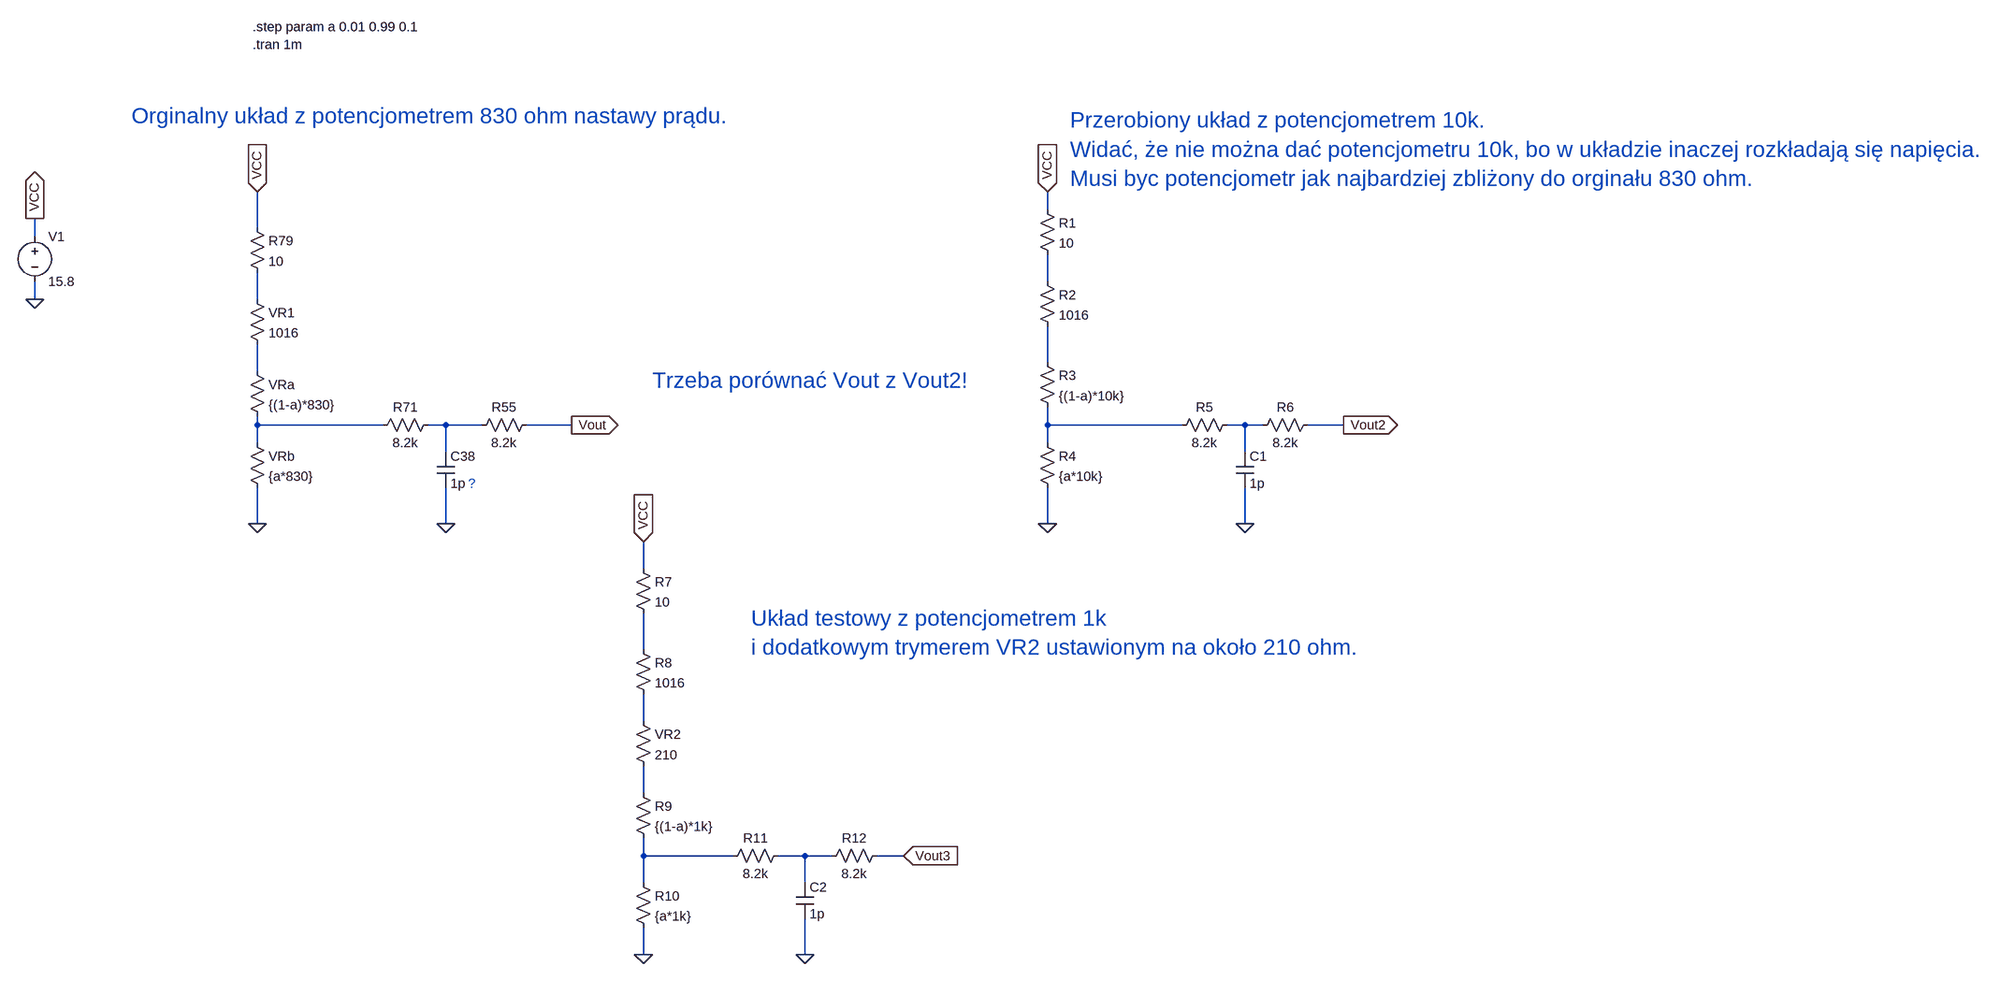
[diagram p0: schematic magnum_power_vip_4000.asc]
magnum_power_vip_4000.asc, the LTspice schematic file:
Version 4
SHEET 1 3352 1364
WIRE 1552 16 1552 -16
WIRE 144 48 144 -16
WIRE -336 64 -336 32
WIRE 1552 144 1552 96
WIRE -336 176 -336 144
WIRE 144 176 144 128
WIRE 1552 288 1552 224
WIRE 144 304 144 256
WIRE 144 400 144 384
WIRE 368 400 144 400
WIRE 480 400 448 400
WIRE 544 400 480 400
WIRE 704 400 624 400
WIRE 1552 400 1552 368
WIRE 1792 400 1552 400
WIRE 1904 400 1872 400
WIRE 1936 400 1904 400
WIRE 2080 400 2016 400
WIRE 144 432 144 400
WIRE 1552 432 1552 400
WIRE 480 448 480 400
WIRE 1904 448 1904 400
WIRE 144 576 144 512
WIRE 480 576 480 512
WIRE 1552 576 1552 512
WIRE 1904 576 1904 512
WIRE 832 656 832 608
WIRE 832 800 832 736
WIRE 832 928 832 880
WIRE 832 1056 832 1008
WIRE 832 1168 832 1136
WIRE 992 1168 832 1168
WIRE 1120 1168 1072 1168
WIRE 1168 1168 1120 1168
WIRE 1296 1168 1248 1168
WIRE 832 1216 832 1168
WIRE 1120 1216 1120 1168
WIRE 832 1344 832 1296
WIRE 1120 1344 1120 1280
FLAG 144 576 0
FLAG 480 576 0
FLAG 144 -16 VCC
IOPIN 144 -16 In
FLAG -336 176 0
FLAG -336 32 VCC
IOPIN -336 32 Out
FLAG 704 400 Vout
IOPIN 704 400 Out
FLAG 1552 576 0
FLAG 1904 576 0
FLAG 1552 -16 VCC
IOPIN 1552 -16 In
FLAG 2080 400 Vout2
IOPIN 2080 400 Out
FLAG 832 1344 0
FLAG 1120 1344 0
FLAG 1296 1168 Vout3
IOPIN 1296 1168 In
FLAG 832 608 VCC
IOPIN 832 608 In
SYMBOL res 128 32 R0
SYMATTR InstName R79
SYMATTR Value 10
SYMBOL res 128 160 R0
SYMATTR InstName VR1
SYMATTR Value 1016
SYMBOL res 128 288 R0
SYMATTR InstName VRa
SYMATTR Value {(1-a)*830}
SYMBOL res 128 416 R0
SYMATTR InstName VRb
SYMATTR Value {a*830}
SYMBOL res 464 384 R90
WINDOW 0 0 56 VBottom 2
WINDOW 3 32 56 VTop 2
SYMATTR InstName R71
SYMATTR Value 8.2k
SYMBOL res 640 384 R90
WINDOW 0 0 56 VBottom 2
WINDOW 3 32 56 VTop 2
SYMATTR InstName R55
SYMATTR Value 8.2k
SYMBOL cap 464 448 R0
SYMATTR InstName C38
SYMATTR Value 1p
SYMBOL voltage -336 48 R0
WINDOW 123 0 0 Left 0
WINDOW 39 0 0 Left 0
SYMATTR InstName V1
SYMATTR Value 15.8
SYMBOL res 1536 0 R0
SYMATTR InstName R1
SYMATTR Value 10
SYMBOL res 1536 128 R0
SYMATTR InstName R2
SYMATTR Value 1016
SYMBOL res 1536 272 R0
SYMATTR InstName R3
SYMATTR Value {(1-a)*10k}
SYMBOL res 1536 416 R0
SYMATTR InstName R4
SYMATTR Value {a*10k}
SYMBOL res 1888 384 R90
WINDOW 0 0 56 VBottom 2
WINDOW 3 32 56 VTop 2
SYMATTR InstName R5
SYMATTR Value 8.2k
SYMBOL res 2032 384 R90
WINDOW 0 0 56 VBottom 2
WINDOW 3 32 56 VTop 2
SYMATTR InstName R6
SYMATTR Value 8.2k
SYMBOL cap 1888 448 R0
SYMATTR InstName C1
SYMATTR Value 1p
SYMBOL res 816 640 R0
SYMATTR InstName R7
SYMATTR Value 10
SYMBOL res 816 784 R0
SYMATTR InstName R8
SYMATTR Value 1016
SYMBOL res 816 1040 R0
SYMATTR InstName R9
SYMATTR Value {(1-a)*1k}
SYMBOL res 816 1200 R0
SYMATTR InstName R10
SYMATTR Value {a*1k}
SYMBOL res 1088 1152 R90
WINDOW 0 0 56 VBottom 2
WINDOW 3 32 56 VTop 2
SYMATTR InstName R11
SYMATTR Value 8.2k
SYMBOL res 1264 1152 R90
WINDOW 0 0 56 VBottom 2
WINDOW 3 32 56 VTop 2
SYMATTR InstName R12
SYMATTR Value 8.2k
SYMBOL cap 1104 1216 R0
SYMATTR InstName C2
SYMATTR Value 1p
SYMBOL res 816 912 R0
SYMATTR InstName VR2
SYMATTR Value 210
TEXT 520 504 Left 2 ;?
TEXT 136 -280 Left 2 !.tran 1m
TEXT 136 -312 Left 2 !.step param a 0.01 0.99 0.1
TEXT -80 -152 Left 4 ;Orginalny układ z potencjometrem 830 ohm nastawy prądu.
TEXT 1592 -144 Left 4 ;Przerobiony układ z potencjometrem 10k.\nWidać, że nie można dać potencjometru 10k, bo w układzie inaczej rozkładają się napięcia.\nMusi byc potencjometr jak najbardziej zbliżony do orginału 830 ohm.
TEXT 848 320 Left 4 ;Trzeba porównać Vout z Vout2!
TEXT 1024 744 Left 4 ;Układ testowy z potencjometrem 1k\ni dodatkowym trymerem VR2 ustawionym na około 210 ohm.

The netlist it stands for:
* magnum_power_vip_4000.asc
R79 VCC N002 10
R§VR1 N002 N004 1016
R§VRa N004 N005 {(1-a)*830}
R§VRb N005 0 {a*830}
R71 N006 N005 8.2k
R55 Vout N006 8.2k
C38 N006 0 1p
V1 VCC 0 15.8
R1 VCC N001 10
R2 N001 N003 1016
R3 N003 N007 {(1-a)*10k}
R4 N007 0 {a*10k}
R5 N008 N007 8.2k
R6 Vout2 N008 8.2k
C1 N008 0 1p
R7 VCC N009 10
R8 N009 N010 1016
R9 N011 N012 {(1-a)*1k}
R10 N012 0 {a*1k}
R11 N013 N012 8.2k
R12 Vout3 N013 8.2k
C2 N013 0 1p
R§VR2 N010 N011 210
* ?
.tran 1m
.step param a 0.01 0.99 0.1
* Orginalny układ z potencjometrem 830 ohm nastawy prądu.
* Przerobiony układ z potencjometrem 10k.
* Widać, że nie można dać potencjometru 10k, bo w układzie inaczej rozkładają się napięcia.
* Musi byc potencjometr jak najbardziej zbliżony do orginału 830 ohm.
* Trzeba porównać Vout z Vout2!
* Układ testowy z potencjometrem 1k
* i dodatkowym trymerem VR2 ustawionym na około 210 ohm.
.backanno
.end